# Altium schematic sheet 04_Debugging.SchDoc
size A4; Organization: OLTEST; Revision: 01; SheetNumber: 4; SheetTotal: 13; Название листа: Название листа; Разработчик: Бондарчук С.; Прибор: R100; АМАК.000000.000 Э3: R100.230.030.000-00; Дата: 16.04.2019; Формат: A4; WorkspaceName: R100_Boards_v1
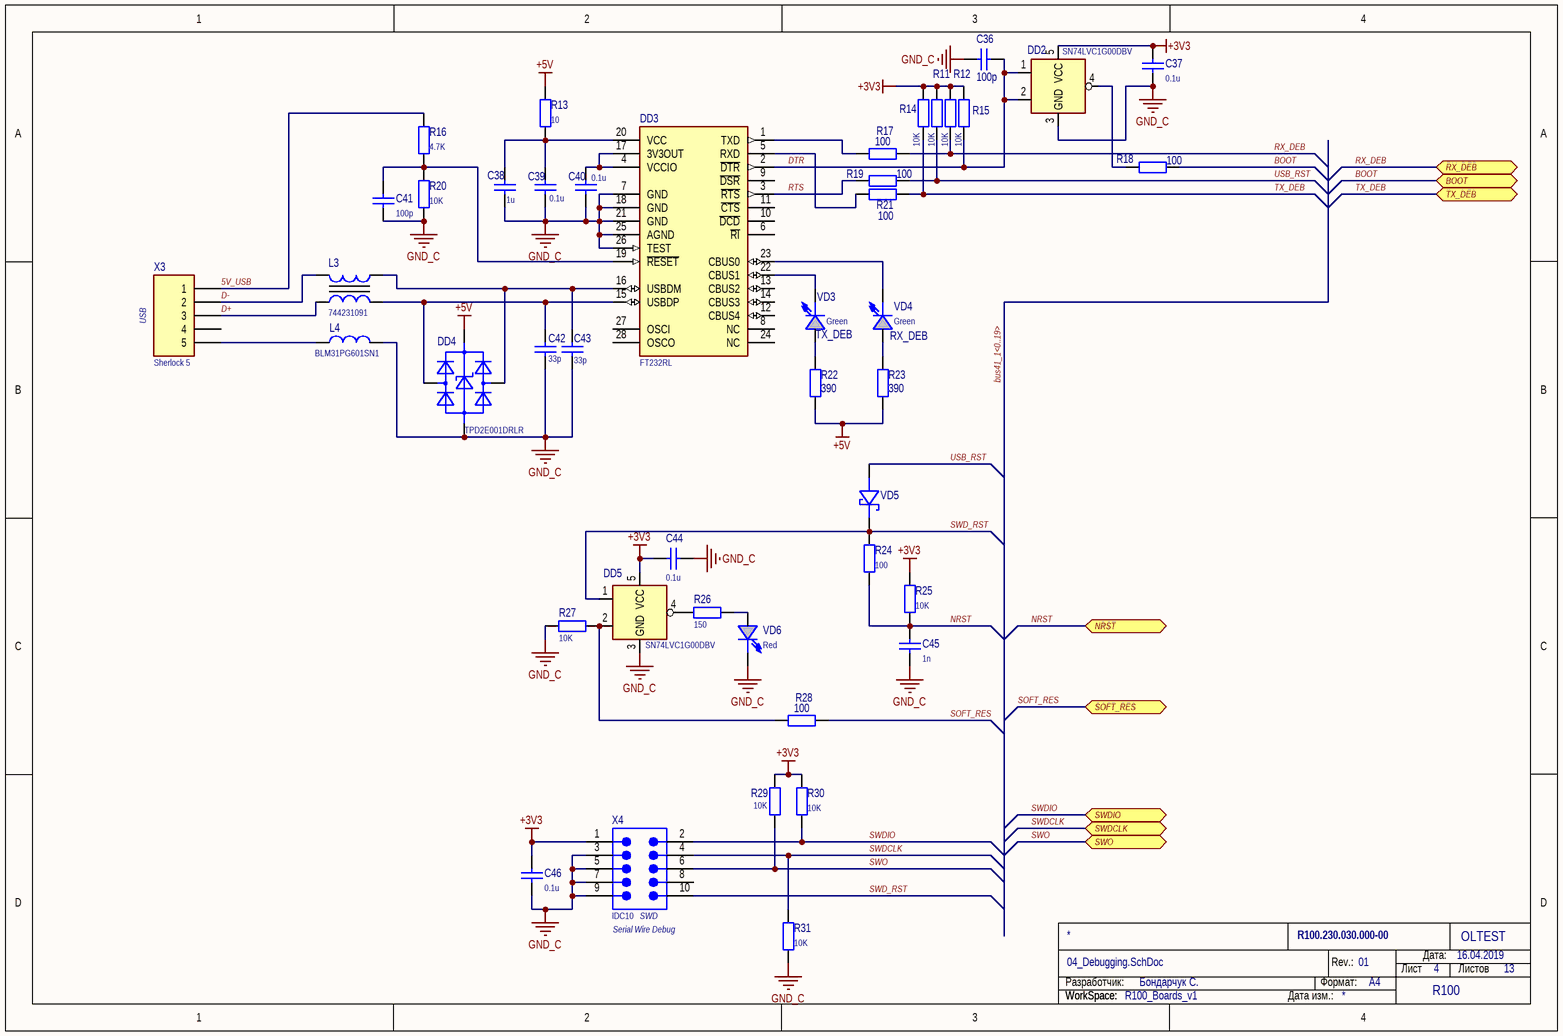
[diagram p0: 04_Debugging.SchDoc]

## Parts
C36  100p  [SMD_C_0603]
C37  0.1u  [SMD_C_0603]
C38  1u  [SMD_C_0603]
C39  0.1u  [SMD_C_0603]
C40  0.1u  [SMD_C_0603]
C41  100p  [SMD_C_0603]
C42  33p  [SMD_C_0603]
C43  33p  [SMD_C_0603]
C44  0.1u  [SMD_C_0603]
C45  1n  [SMD_C_0603]
C46  0.1u  [SMD_C_0603]
DD2  SN74LVC1G00DBV  [SOT-23(DBV)]
DD3  FT232RL  [SSOP-28_M]
DD4  TPD2E001DRLR  [DRL5_M]
DD5  SN74LVC1G00DBV  [SOT-23(DBV)]
L3  744231091  [WE-CNSW-0805]
L4  BLM31PG601SN1  [SMD_L_1206]
R11  10K  [SMD_R_0603]
R12  10K  [SMD_R_0603]
R13  10  [SMD_R_0805]
R14  10K  [SMD_R_0603]
R15  10K  [SMD_R_0603]
R16  4.7K  [SMD_R_0805]
R17  100  [SMD_R_0603]
R18  100  [SMD_R_0603]
R19  100  [SMD_R_0603]
R20  10K  [SMD_R_0805]
R21  100  [SMD_R_0603]
R22  390  [SMD_R_0805]
R23  390  [SMD_R_0805]
R24  100  [SMD_R_0603]
R25  10K  [SMD_R_0603]
R26  150  [SMD_R_0805]
R27  10K  [SMD_R_0603]
R28  100  [SMD_R_0603]
R29  10K  [SMD_R_0603]
R30  10K  [SMD_R_0603]
R31  10K  [SMD_R_0603]
VD3  value Green  [SMD_LED_LL_Green]  (hidden comment: LL-S172GC-2A)
VD4  value Green  [SMD_LED_LL_Green]  (hidden comment: LL-S172GC-2A)
VD5  MBR0540T1G  [SOD-123]  (value not drawn)
VD6  value Red  [SMD_LED_LL_Red]  (hidden comment: LL-S172SC-2S)
X3  Sherlock 5  [35362-0550]
X4  IDC10  [918510x324]

## Ports
BOOT, NRST, RX_DEB, SOFT_RES, SWDCLK, SWDIO, SWO, TX_DEB

## Nets
+3V3: C37.1 C44.2 C46.2 DD2.5(VCC) DD5.5(VCC) R11.2 R12.2 R14.2 R15.2 R25.2 R29.2 R30.2 X4.1
+5V: DD4.1(VCC) R13.2 R22.1 R23.1
GND_C: C36.2 C37.2 C38.1 C39.1 C40.1 C41.1 C42.2 C43.2 C44.1 C45.1 C46.1 DD2.3(GND) DD3.7(GND) DD3.18(GND) DD3.21(GND) DD3.25(AGND) DD3.26(TEST) DD4.4(GND) DD5.3(GND) L4.2 R20.1 R27.2 R31.1 VD6.2(CATHODE) X4.3 X4.5 X4.7 X4.9
5V_USB: R16.2 X3.1
BOOT: R18.2 ; port BOOT
D+: L3.1 X3.3
D-: L3.4 X3.2
DTR: C36.1 DD2.1 DD2.2 DD3.2(~{DTR}) R15.1
NRST: C45.2 R24.1 R25.1 ; port NRST
RTS: DD3.3(~{RTS}) R19.1
RX_DEB: R12.1 R17.2 ; port RX_DEB
SOFT_RES: R28.2 ; port SOFT_RES
SWD_RST: DD5.1 R24.2 VD5.1(Cathode) X4.10
SWDCLK: R31.2 X4.4 ; port SWDCLK
SWDIO: R30.1 X4.2 ; port SWDIO
SWO: R29.1 X4.6 ; port SWO
TX_DEB: R14.1 R21.2 ; port TX_DEB
USB_RST: R11.1 R19.2 VD5.2(Anode)
NetC38_2: C38.2 C39.2 DD3.20(VCC) R13.1
NetC40_2: C40.2 DD3.4(VCCIO) DD3.17(3V3OUT)
NetC41_2: C41.2 DD3.19(~{RESET}) R16.1 R20.2
NetC42_1: C42.1 DD3.15(USBDP) DD4.3(IO1) L3.2
NetC43_1: C43.1 DD3.16(USBDM) DD4.5(IO2) L3.3
NetDD2_4: DD2.4 R18.1
NetDD3_1: DD3.1(TXD) R17.1
NetDD3_5: DD3.5(RXD) R21.1
NetDD3_22: DD3.22(CBUS1) VD3.2(CATHODE)
NetDD3_23: DD3.23(CBUS0) VD4.2(CATHODE)
NetDD5_2: DD5.2 R27.1 R28.1
NetDD5_4: DD5.4 R26.1
NetL4_1: L4.1 X3.5
NetR22_2: R22.2 VD3.1(ANODE)
NetR23_2: R23.2 VD4.1(ANODE)
NetR26_2: R26.2 VD6.1(ANODE)

Not connected (* = marked no-connect by the designer): DD3 6(~{RI}) 8(NC) 9(~{DSR}) 10(~{DCD}) 11(~{CTS}) 12(CBUS4) 13(CBUS2) 14(CBUS3) 24(NC) 27(OSCI) 28(OSCO); X3 4; X4 8

## Buses and harness runs
bus bus41_1<0..19>

## Notes on the sheet
- (near X3) USB
- (near VD3) TX_DEB
- (near VD4) RX_DEB
- (near X4) SWD
- (near X4) Serial Wire Debug
- Разработчик:
- Формат:
- Rev.:
- Лист
- Дата:
- Листов
- WorkSpace:
- Дата изм.:
- (in symbol SN74LVC1G00DBV) &

## Library data of the parts
C36 C41 = C0603 100p 100V 5%: SMD C 0603 MURATA 100V 5% NP0; PartNumber: GRM1885C2A101JA01; Manufacturer: MURATA; Value: 100p
C37 C39 C40 C44 C46 = C0603 0.1u 50V 10%: SMD C 0603 MURATA 50V 10% X7R; PartNumber: GRM188R71H104K; Manufacturer: MURATA; Value: 0.1u
C38 = C0603 1uF 25V 10%: SMD C 0603 MURATA 25V 10% X7R; PartNumber: GRM188R71E105KA12; Manufacturer: MURATA; Value: 1u
C42 C43 = C0603 33p 50V 5%: SMD C 0603 MURATA 50V 5% NP0; PartNumber: GRM1885C1H330JA01; Manufacturer: MURATA; Value: 33p
C45 = C0603 1n 50V 5%: SMD C 0603 MURATA 50V 5% NP0; PartNumber: GRM1885C1H102JA01; Manufacturer: MURATA; Value: 1n
DD2 DD5 = SN74LVC1G00DBV: 2-in NAND; Manufacturer: Texas Instruments; PartNumber: SN74LVC1G00DBV
DD3 = FT232RL: USB UART Asynchronous Serial Data Transfer Chip, 28-pin SSOP; Manufacturer: FTDI; PartNumber: FT232RL
DD4 = TPD2E001DRLR: Low-Capacitance + / - 15 kV ESD-Protection Array for High-Speed Data Interfaces, 2 Channels, -40 to +85 degC, 5-pin SOT (DRL), Green (RoHS & no Sb/Br); Manufacturer: Texas Instruments; PartNumber: TPD2E001DRLR
L3 = 744231091: SMD Common Mode Noise Suppressor WE-CNSW, Z = 90 Ohm; Manufacturer: Wurth Elektronik; Impedance: 90 Ohm; DatasheetVersion: ver 4, Nov-2010; PackageReference: WE-CNSW-0805; PackageDescription: SMD Inductor, 4-Leads, Body 1.4 x 2.2 mm; PartNumber: 744231091
L4 = BLM31PG601SN1: 600R 1.5A (100MHz); Manufacturer: TDK; Value: 600R 1.5A (100MHz); PartNumber: BLM31PG601SN1
R11 R12 R14 R15 R25 R27 R29-R31 = R0603 10К 1%: SMD R 0603 VISHAY 0.1W 75V 1% 100ppm; PartNumber: CRCW060310K0FK; Manufacturer: VISHAY; Value: 10K
R13 = R0805 10 1%: SMD R 0805 VISHAY 0.125W 150V 1% 100ppm; PartNumber: CRCW080510R0FK; Manufacturer: VISHAY; Value: 10
R16 = R0805 4.7K 1%: SMD R 0805 VISHAY 0.125W 150V 1% 100ppm; PartNumber: CRCW08054K70FK; Manufacturer: VISHAY; Value: 4.7K
R17-R19 R21 R24 R28 = R0603 100 1%: SMD R 0603 VISHAY 0.1W 75V 1% 100ppm; PartNumber: CRCW0603100RFK; Manufacturer: VISHAY; Value: 100
R20 = R0805 10K 1%: SMD R 0805 VISHAY 0.125W 150V 1% 100ppm; PartNumber: CRCW080510K0FK; Manufacturer: VISHAY; Value: 10K
R22 R23 = R0805 390R 1%: SMD R 0805 VISHAY 0.125W 150V 1% 100ppm; PartNumber: CRCW0805390RFK; Manufacturer: VISHAY; Value: 390
R26 = R0805 150 1%: SMD 0805 VISHAY 0.125W 150V 1% 100ppm; PartNumber: CRCW0805150RFK; Manufacturer: VISHAY; Value: 150
VD3 VD4 = LL-S172GC-2A: LED Green SMD; Manufacturer: Lucky Light; PartNumber: LL-S172GC-2A
VD5 = MBR0540T1G: 0.5A/40V Schottky Diode (SOD-123); Manufacturer: ON Semiconductor; PartNumber: MBR0540T1G
VD6 = LL-S172SC-2S: LED Red SMD; Manufacturer: Lucky Light; PartNumber: LL-S172SC-2S
X3 = 35362-0550: Sherlock 5 Top, 2A 125V 2mm; Manufacturer: MOLEX; PartNumber: 35362-0550
X4 = Harting IDC10 904: Flat Cable Connector (IDC), Standard Male Header, Straight Solder Pin, 10 Contacts, Long Levers, Performance Level 2; PartNumber: 09 18 510 6904; PCB_Layout: Complies with manufacturer's recommendation.; DrillSize: Corresponds to nominal value.; Published: 15-Nov-2004; DatasheetDocument: Sep-2003; PackageDocument: Jun-2000; PackageReference: 918510x904; Publisher: Altium Limited; ComponentLink1Description: Manufacturer Link; ComponentLink1URL: http://www.harting.com/; ComponentLink2Description: Selection Guide; ComponentLink2URL: http://www.harting.com/imperia/md/content/steckverbinderundsystemkomponenten/folder/interface_engl_chapter_09.pdf